# Altium schematic sheet Peripherals.SchDoc
size A4; SheetNumber: 6; SheetTotal: 9
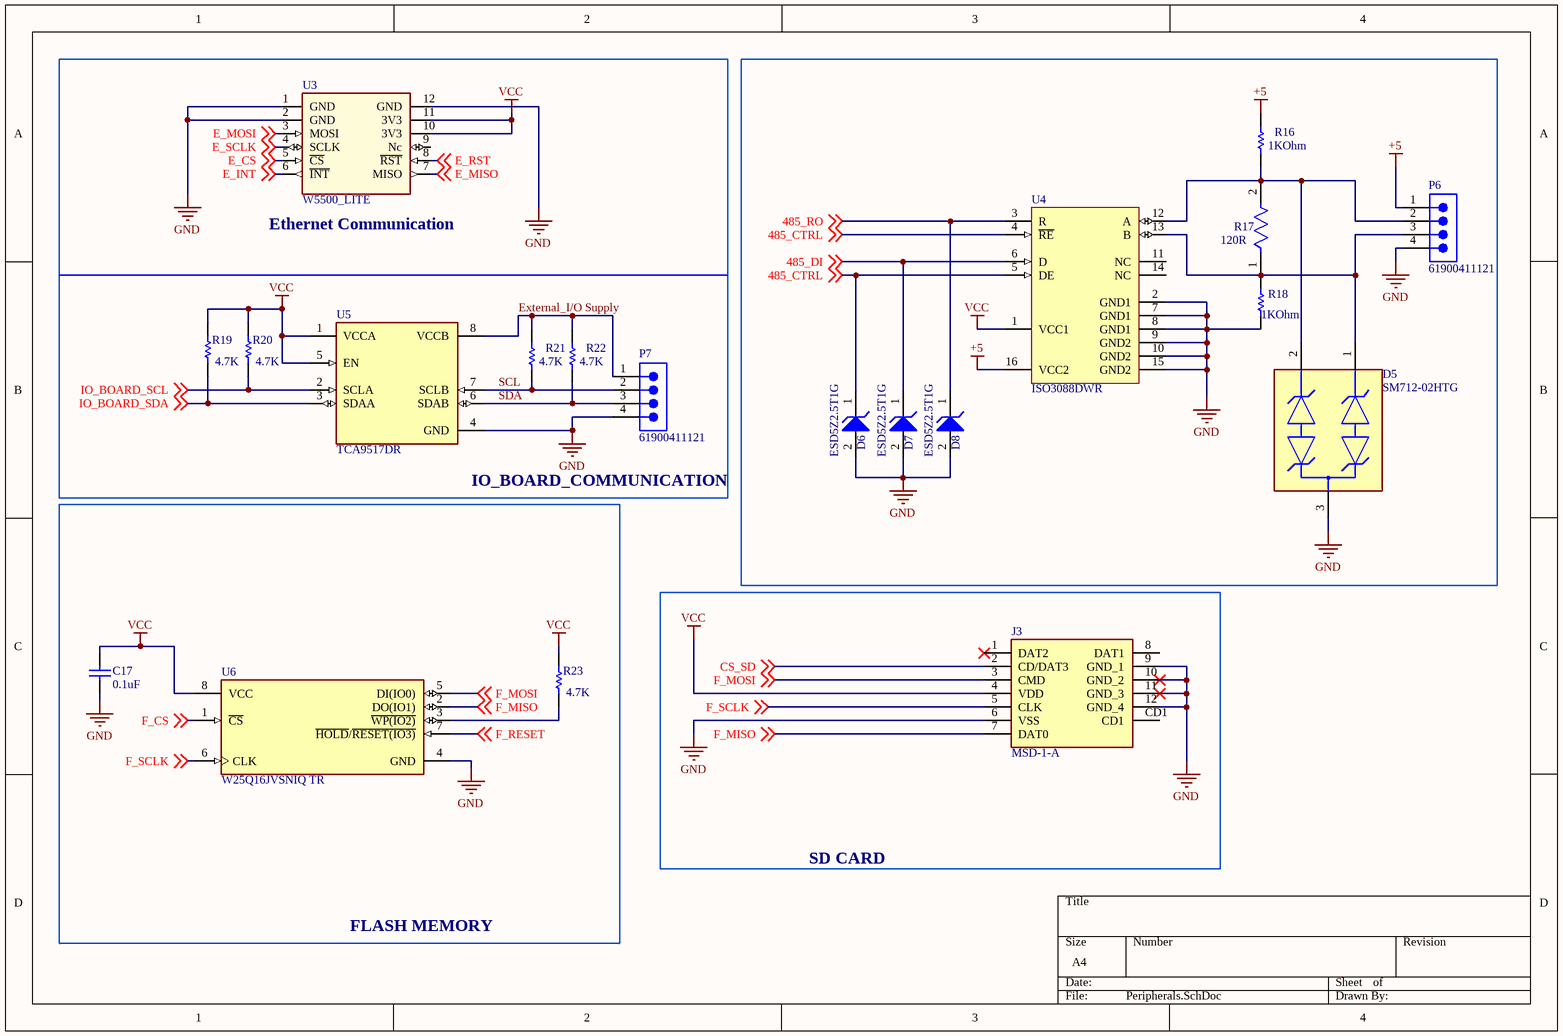
[diagram p0: Peripherals.SchDoc]

## Parts
C17  0.1uF  [CAPC1608X92X38ML15T08]
D5  SM712-02HTG  [FP-SM712-MFG]
D6  ESD5Z2.5T1G  [ONSC-SOD-523-2-502-01_V]
D7  ESD5Z2.5T1G  [ONSC-SOD-523-2-502-01_V]
D8  ESD5Z2.5T1G  [ONSC-SOD-523-2-502-01_V]
J3  MSD-1-A  [MSD1A]
P6  61900411121  [61900411121]
P7  61900411121  [61900411121]
R16  Resistance: 1KOhm  [RESC2013X60X35ML10T20]  (hidden comment: RC0805FR-071KL)
R17  Resistance: 120R  [FP-CRCW0805-e3-MFG]  (hidden comment: CRCW0805120RFKEA)
R18  Resistance: 1KOhm  [RESC2013X60X35ML10T20]  (hidden comment: RC0805FR-071KL)
R19  Resistance: 4.7K  [YAGO-RC0805_M]  (hidden comment: RC0805FR-074K7L)
R20  Resistance: 4.7K  [YAGO-RC0805_M]  (hidden comment: RC0805FR-074K7L)
R21  Resistance: 4.7K  [YAGO-RC0805_M]  (hidden comment: RC0805FR-074K7L)
R22  Resistance: 4.7K  [YAGO-RC0805_M]  (hidden comment: RC0805FR-074K7L)
R23  Resistance: 4.7K  [YAGO-RC0805_M]  (hidden comment: RC0805FR-074K7L)
U3  W5500_LITE  [W5500]
U4  ISO3088DWR  [DW0016B_N]
U5  TCA9517DR  [FP-D0008A-MFG]
U6  W25Q16JVSNIQ TR  [FP-W25Q16JVSNIQ_TR-IPC_A]

## Blocks framed on the sheet
SD CARD: J3

## Nets
+5: P6.1 R16.2 U4.16(VCC2)
GND: C17.1 D5.3 D6.2(A) D7.2(A) D8.2(A) J3.6(VSS) J3.9(GND_1) J3.10(GND_2) J3.11(GND_3) J3.12(GND_4) P6.4 P7.4 R18.1 U3.1(GND) U3.2(GND) U3.12(GND) U4.2(GND1) U4.7(GND1) U4.8(GND1) U4.9(GND2) U4.10(GND2) U4.15(GND2) U5.4(GND) U6.4(GND)
VCC: C17.2 J3.4(VDD) R19.2 R20.2 R23.2 U3.10(3V3) U3.11(3V3) U4.1(VCC1) U5.1(VCCA) U5.5(EN) U6.8(VCC)
485_CTRL: D6.1(K) U4.4(~{RE}) U4.5(DE) ; off-sheet 485_CTRL
485_DI: D7.1(K) U4.6(D) ; off-sheet 485_DI
485_RO: D8.1(K) U4.3(R) ; off-sheet 485_RO
CS_SD: J3.2(CD/DAT3) ; off-sheet CS_SD
E_CS: U3.5(~{CS}) ; off-sheet E_CS
E_INT: U3.6(~{INT}) ; off-sheet E_INT
E_MISO: U3.7(MISO) ; off-sheet E_MISO
E_MOSI: U3.3(MOSI) ; off-sheet E_MOSI
E_RST: U3.8(~{RST}) ; off-sheet E_RST
E_SCLK: U3.4(SCLK) ; off-sheet E_SCLK
External_I/O Supply: P7.1 R21.2 R22.2 U5.8(VCCB)
F_CS: U6.1(~{CS}) ; off-sheet F_CS
F_MISO: J3.7(DAT0) U6.2(DO(IO1)) ; off-sheet F_MISO
F_MOSI: J3.3(CMD) U6.5(DI(IO0)) ; off-sheet F_MOSI
F_RESET: U6.7(~{HOLD}/~{RESET(IO3)}) ; off-sheet F_RESET
F_SCLK: J3.5(CLK) U6.6(CLK) ; off-sheet F_SCLK
IO_BOARD_SCL: R20.1 U5.2(SCLA) ; off-sheet IO_BOARD_SCL
IO_BOARD_SDA: R19.1 U5.3(SDAA) ; off-sheet IO_BOARD_SDA
SCL: P7.2 R21.1 U5.7(SCLB)
SDA: P7.3 R22.1 U5.6(SDAB)
NetD5_1: D5.1 P6.3 R17.1 R18.2 U4.13(B)
NetD5_2: D5.2 P6.2 R16.1 R17.2 U4.12(A)
NetR23_1: R23.1 U6.3(~{WP(IO2)})

Not connected (* = marked no-connect by the designer): J3 1(DAT2)* 8(DAT1) CD1; U3 9(Nc); U4 11(NC) 14(NC)

## Notes on the sheet
- (near U3) Ethernet Communication
- IO_BOARD_COMMUNICATION
- FLASH MEMORY

## Library data of the parts
C17 = CMP-2006-01211-1: Manufacturer: Vitramon; Part Number: VJ0603Y104KXJAP
D5 = CMP-2000-07561-2: TVS DIODE 12V 31V SOT23-3; Leakage Current: 20uA; Polarity: Bidirectional; Breakdown Voltage: 13.3V; Max Power Dissipation: 600W; Number of Channels: 2; Max Surge Current: 19A; Capacitance: 75pF; Power Line Protection: No; Element Configuration: Dual; Number of Pins: 3; Radiation Hardening: No; Clamping Voltage: 31V; Mount: Surface Mount; Reverse Standoff Voltage: 12V; Peak Pulse Power: 600W; Lead Free: Lead Free; Direction: Bidirectional; Packaging: Tape and Reel; Case/Package: SOT-23-3; Number of Bidirectional Channels: 2; Termination: SMD/SMT; Max Operating Temperature: 125°C; Min Breakdown Voltage: 13.3V; Depth: 1.4mm; Package Quantity: 3000; Working Voltage: 12V; Length: 3.04mm; Peak Pulse Current: 19A; Composition: Zener; Min Operating Temperature: -40°C
D6-D8 = CMP-1063-00103-1: Transient Voltage Suppressor, Micro-Packaged Diode for ESD Protection, 2-Pin SOD-523, Pb-Free, Tape and Reel; Manufacturer: On Semiconductor; Direction: Unidirectional; PPK Max (W): 120; V(BR) Min (V): 4; VRWM Max (V): 2.5; Number of Lines: 1; IR Max (uA): 6; ComponentLink3Description: Package Specification; Packing: Tape and Reel; ComponentLink2URL: http://www.onsemi.cn/pub_link/Collateral/ESD5Z2.5T1-D.PDF; ComponentLink3URL: http://www.onsemi.com/pub_link/Collateral/502-01.PDF; PackageReference: SOD-523-2-502-01; PartNumber: ESD5Z2.5T1G; Mounting Technology: Surface Mount; DatasheetVersion: Rev. 10; PackageVersion: Rev. E, 09/2010; RoHS: Pb-Free; ComponentLink1Description: Manufacturer URL; PackageDescription: 2-Pin SOD, Body 1.2 x 0.8 mm; ComponentLink2Description: Datasheet; ComponentLink1URL: http://www.onsemi.com/
J3 = MSD-1-A: Micro SD Card Connector, 9 Positions, Connector and Ejector, Push In, Auto Eject Out, Surface Mount, 1.8 mm Height Above Board, Gold Flash; Manufacturer_Name: Same Sky; Geometry.Height: 2mm; Mouser Part Number: 179-MSD-1-A; Mouser Price/Stock: https://www.mouser.co.uk/ProductDetail/Same-Sky/MSD-1-A?qs=Z%252BL2brAPG1Ip18XLC4tUPQ%3D%3D; Manufacturer_Part_Number: MSD-1-A; Datasheet Link: https://www.sameskydevices.com/product/resource/msd-1-a.pdf
P6 P7 = CMP-1502-00586-2: NexarPartId: 18818226; Connector Type: Male Pin; Insulation: Insulated; Number of Positions: 4; Gender: Male; Operating Supply Voltage: 250V; Pitch: 2.54mm; Current Rating: 3A; Insulation Resistance: 1GΩ; Contact Resistance: 20mΩ; Termination: Through Hole; Contact Material: Copper; Height: 3.3mm; Width: 10.2mm; RoHS: Compliant; REACH SVHC: Unknown; Max Operating Temperature: 105°C; Contact Plating: Tin; Lead Free: Lead Free; Contact Gender: Male; Lead Pitch: 2.54mm; Flammability Rating: UL94 V-0; Packaging: Bulk; Housing Material: Nylon; Number of Pins: 4; Number of Contacts: 4; Color: Beige; Number of Rows: 1; Orientation: Vertical; Contact Mating Length: 7.493mm; Mount: Through Hole; Min Operating Temperature: -40°C; Voltage Rating: 250V; Fastening Type: Friction; Length: 10.16mm
R16 R18 = CMP-2100-03671-1: Chip Resistor, 1 KOhm, +/- 1%, 125 mW, -55 to 155 degC, 0805 (2012 Metric), RoHS, Tape and Reel; Manufacturer: Yageo; Temperature Coefficient: 100ppm/degreesC; Voltage Rating (DC): 150V; Max Power Dissipation: 125mW; Number of Pins: 2; Number of Terminations: 2; Datasheet URL: http://www.yageo.com/NewPortal/yageodocoutput?fileName=/pdf/R-Chip/PYu-RC_Group_51_RoHS_L_5.pdf; Length: 0.079inch; Package Description: 2-Pin Surface Mounted Device, Body 2 x 1.25 mm; Depth: 1.25mm; Height: 0.024inch; Military Standard: Not; Case/Package: 0805; Package Reference: 0805; RoHSCompliant: true; Lead Free: LeadFree; Packaging: TapeandReel; Package Quantity: 1; Datasheet Version: Rev. 5, 10/2016; Tolerance: 1%; Min Operating Temperature: -55degC; Voltage Rating: 150V; Composition: ThickFilm; Case Code (Imperial): 0805; Power Rating: 125mW; Width: 0.049inch; Case Code (Metric): 2012; Manufacturer URL: http://www.yageo.com/; Max Operating Temperature: 155degC; REACH SVHC: Unknown; Termination: SMD/SMT
R17 = CMP-02407-007854-1: RES Thick Film, 120Ω, 1%, 0.125W, 100ppm/°C, 0805; Voltage Rating (DC): 150V; Max Power Dissipation: 125mW; Height: 0.45mm; Min Operating Temperature: -55°C; Packaging: Tape and Reel; Package Quantity: 10; Width: 1.25mm; Weight: 0.000194oz; Termination: SMD/SMT; Mount: Surface Mount; Tolerance: 1%; Military Standard: Not; Max Operating Temperature: 155°C; Lead Free: Lead Free; Number of Terminations: 2; Radiation Hardening: No; Temperature Coefficient: 100ppm/°C; Length: 2mm; Case/Package: 0805; Voltage Rating: 150V; Case Code (Metric): 2012; Case Code (Imperial): 0805; Features: Automotive AEC-Q200; Composition: Thick Film; Contact Plating: Tin; Power Rating: 125mW; Depth: 1.25mm
R19-R23 = CMP-1568-00001-1: General Puprose Chip Resistor, 4700 Ohm +/- 1%, 0.125 W, -55 to 155 degC, 2-Pin SMD, RoHS, Tape and Reel; Tolerance: +/- 1%; Power: 0.125 W; PackageDescription: 2-Pin Surface Mount Device, Body 2 x 1.25 mm; ComponentLink2URL: http://www.yageo.com/documents/recent/PYu-RC_Group_51_RoHS_L-3.pdf; Temperature Min: -55 degC; Packing: Tape and Reel; Mounting Technology: Surface Mount; PartNumber: RC0805FR-074K7L; ComponentLink1URL: http://www.yageo.com/NewPortal/_en/index.jsp; Temperature Max: 155 degC; ComponentLink2Description: Datasheet; DatasheetVersion: Rev. 3; RoHS: TRUE; ComponentLink1Description: Manufacturer URL
U3 = W5500
U4 = CMP-0316-00040-2: Isolated RS-485 Transceiver, 20 Mbps, 5 V, Half Duplex, -40 to 85 degC, 16-pin SOIC (DW); Manufacturer: Texas Instruments; Rating: Catalog; ICC(Max)(mA): 15; Fail Safe: Idle, Open, Short; # of TX/RX: 1 TX / 1 RX; Drivers Per Package: 1; Signaling Rate(Mbps): 20; Common Mode Range: -7 to 12; ESD(kV): 16; Supply Voltage(s)(V): 5; Eco-Plan: TBD; Fault Protection(V): -9 to 14; Number of Nodes: 256; Isolated: Yes; Mounting Technology: Surface Mount; PackageVersion: revG, Jan-2011; PartNumber: ISO3088DWR; PackageDescription: 16-Pin Small Outline Integrated Circuit, 10.3 x 7.5 mm, Pitch 1.27 mm Pitch; ComponentLink2Description: Package Specification; SubFamily: RS-485; Duplex: Half; ComponentLink1URL: http://www.ti.com/general/docs/lit/getliterature.tsp?genericPartNumber=ISO3088&fileType=pdf; ComponentLink2URL: http://www.ti.com/litv/pdf/msoi003g; DatasheetVersion: SLOS581E; PackageReference: DW0016B; Code_JEDEC: MS-013-AA; Receivers Per Package: 1; ComponentLink1Description: Datasheet
U5 = CMP-04881-000005-1: IC TRNSLTR BIDIRECTIONAL 8SOIC; Propagation Delay: 110ns; Number of Bits: 2; Min Supply Voltage: 900mV; Output Type: Voltage; Max Supply Voltage: 5.5V; Interface: I2C; Input Capacitance: 8pF; Max Frequency: 400kHz; Number of Circuits: 1; Turn-On Delay Time: 141ns; Logic Function: Translator; Max Operating Temperature: 85°C; Channel Type: Bidirectional; Radiation Hardening: No; Case/Package: SOIC; REACH SVHC: No SVHC; Contact Plating: Gold; Packaging: Tape and Reel; Package Quantity: 2500; Mount: Surface Mount; Number of Pins: 8; Min Operating Temperature: -40°C; Number of Outputs: 2; Number of Channels: 2; Lead Free: Lead Free
U6 = CMP-78876-000009-2: IC FLASH 16MBIT SPI/QUAD 8SOIC; NexarPartId: 75645707; Max Supply Voltage: 3.6V; Memory Size: 2MB; Interface: SPI; Access Time: 5ms; Min Supply Voltage: 2.7V; RoHS: Non-Compliant; Min Operating Temperature: -40°C; Memory Type: FLASH; Height: 1.75mm; Schedule B: 8542320070, 8542320070; Ambient Temperature Range High: 85°C; Max Operating Temperature: 85°C